# Altium schematic sheet PIXRACER-SERIALS-R12.SchDoc
size A4
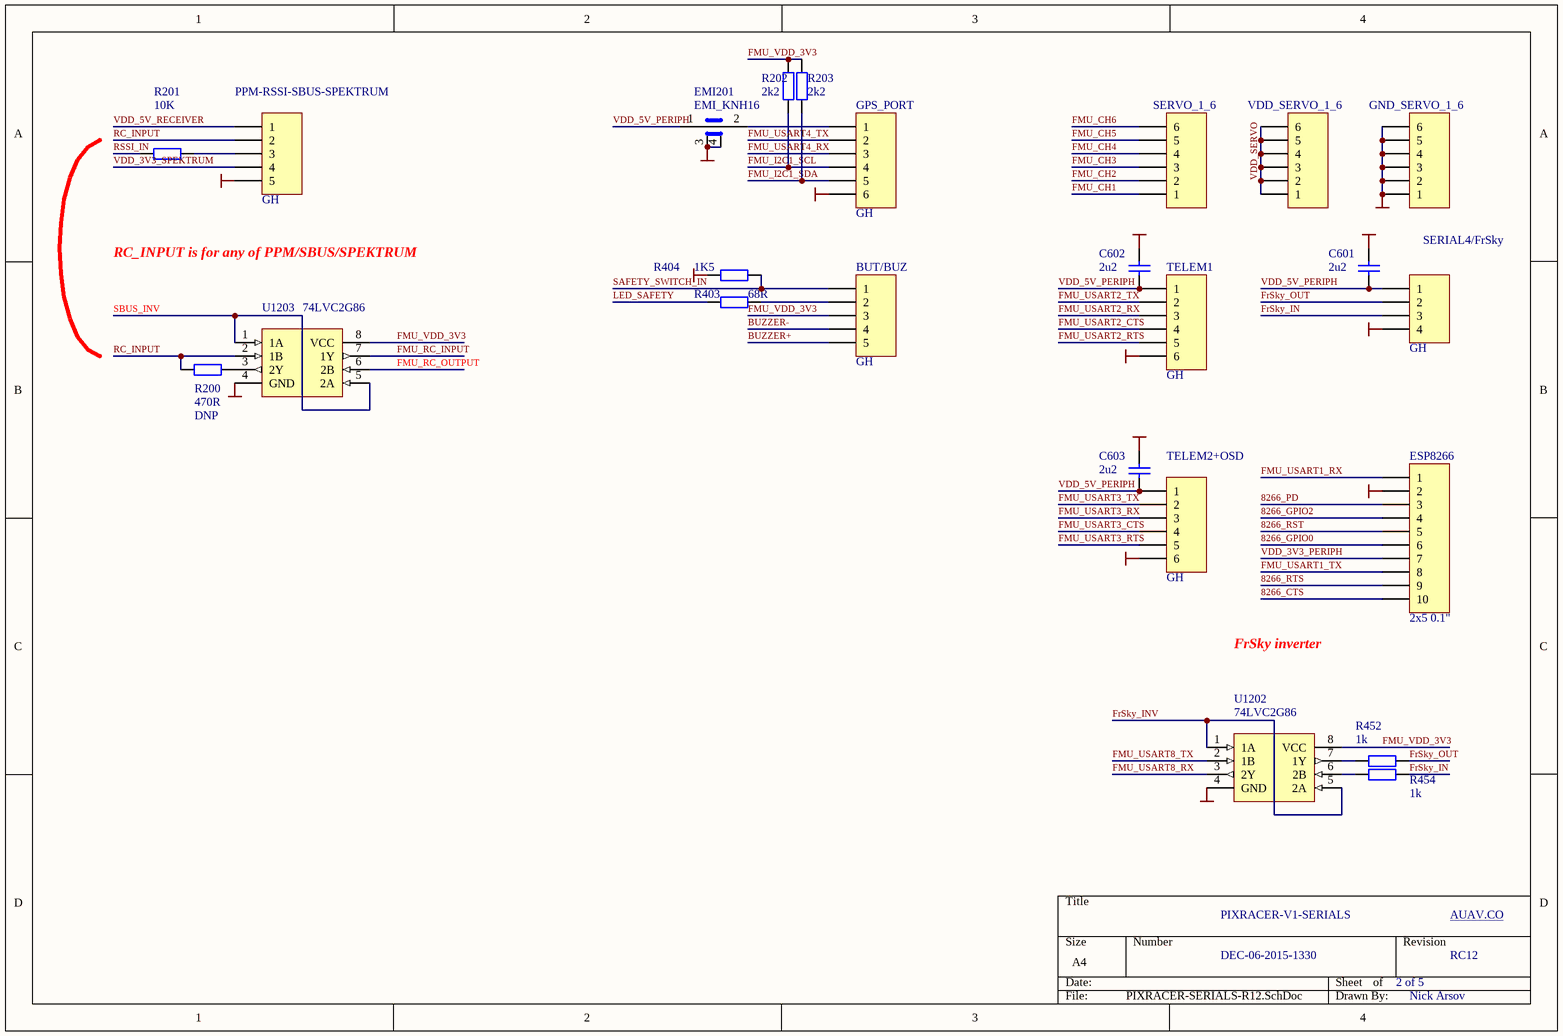
[diagram p0: PIXRACER-SERIALS-R12.SchDoc]

## Parts
BUT/BUZ  GH  [Molex_Clik_1.25_5H]
C601  2u2  [0402A]
C602  2u2  [0402A]
C603  2u2  [0402A]
EMI201  EMI_KNH16  [EMI_KNH16_0603]
ESP8266  2x5 0.1"  [2.54mm_10pin_SMD]
GND_SERVO_1_6  Header 6  [HDR1X6]  (value not drawn)
GPS_PORT  GH  [Molex_Clok_1.25_6H]
PPM-RSSI-SBUS-SPEKTRUM  GH  [Molex_Clik_1.25_5H]
R200  470R  REM: DNP  [0402A]
R201  10K  [0402A]
R202  2k2  [0402A]
R203  2k2  [0402A]
R403  68R  [0402A]
R404  1K5  [0402A]
R452  1k  [0402A]
R454  1k  [0402A]
SERIAL4/FrSky  GH  [Molex_1.25_click_4]
SERVO_1_6  Header 6  [HDR1X6]  (value not drawn)
TELEM1  GH  [Molex_Clok_1.25_6H]
TELEM2+OSD  GH  [Molex_Clok_1.25_6H]
U1202  74LVC2G86  [DCU(SM-8)]
U1203  74LVC2G86  [DCU(SM-8)]
VDD_SERVO_1_6  Header 6  [HDR1X6]  (value not drawn)

## Nets
GND: C601.2 C602.2 C603.2 EMI201.3(G) EMI201.4(G) ESP8266.2 GND_SERVO_1_6.1 GND_SERVO_1_6.2 GND_SERVO_1_6.3 GND_SERVO_1_6.4 GND_SERVO_1_6.5 GND_SERVO_1_6.6 GPS_PORT.6 PPM-RSSI-SBUS-SPEKTRUM.5 R404.2 SERIAL4/FrSky.4 TELEM1.6 TELEM2+OSD.6 U1202.4(GND) U1203.4(GND)
8266_CTS: ESP8266.10
8266_GPIO0: ESP8266.6
8266_GPIO2: ESP8266.4
8266_PD: ESP8266.3
8266_RST: ESP8266.5
8266_RTS: ESP8266.9
BUZZER+: BUT/BUZ.5
BUZZER-: BUT/BUZ.4
FMU_CH1: SERVO_1_6.1
FMU_CH2: SERVO_1_6.2
FMU_CH3: SERVO_1_6.3
FMU_CH4: SERVO_1_6.4
FMU_CH5: SERVO_1_6.5
FMU_CH6: SERVO_1_6.6
FMU_I2C1_SCL: GPS_PORT.4 R202.2
FMU_I2C1_SDA: GPS_PORT.5 R203.2
FMU_RC_INPUT: U1203.7(1Y)
FMU_RC_OUTPUT: U1203.6(2B)
FMU_USART1_RX: ESP8266.1
FMU_USART1_TX: ESP8266.8
FMU_USART2_CTS: TELEM1.4
FMU_USART2_RTS: TELEM1.5
FMU_USART2_RX: TELEM1.3
FMU_USART2_TX: TELEM1.2
FMU_USART3_CTS: TELEM2+OSD.4
FMU_USART3_RTS: TELEM2+OSD.5
FMU_USART3_RX: TELEM2+OSD.3
FMU_USART3_TX: TELEM2+OSD.2
FMU_USART4_RX: GPS_PORT.3
FMU_USART4_TX: GPS_PORT.2
FMU_USART8_RX: U1202.3(2Y)
FMU_USART8_TX: U1202.2(1B)
FMU_VDD_3V3: BUT/BUZ.3 R202.1 R203.1 U1202.8(VCC) U1203.8(VCC)
FrSky_IN: R454.1 SERIAL4/FrSky.3
FrSky_INV: U1202.1(1A) U1202.5(2A)
FrSky_OUT: R452.1 SERIAL4/FrSky.2
LED_SAFETY: R403.2
RC_INPUT: PPM-RSSI-SBUS-SPEKTRUM.2 R200.2 U1203.2(1B)
RSSI_IN: R201.2
SAFETY_SWITCH_IN: BUT/BUZ.1 R404.1
SBUS_INV: U1203.1(1A) U1203.5(2A)
VDD_3V3_PERIPH: ESP8266.7
VDD_3V3_SPEKTRUM: PPM-RSSI-SBUS-SPEKTRUM.4
VDD_5V_PERIPH: C601.1 C602.1 C603.1 EMI201.1(L1) SERIAL4/FrSky.1 TELEM1.1 TELEM2+OSD.1
VDD_5V_RECEIVER: PPM-RSSI-SBUS-SPEKTRUM.1
VDD_SERVO: VDD_SERVO_1_6.1 VDD_SERVO_1_6.2 VDD_SERVO_1_6.3 VDD_SERVO_1_6.4 VDD_SERVO_1_6.5 VDD_SERVO_1_6.6
NetBUT/BUZ_2: BUT/BUZ.2 R403.1
NetEMI201_2: EMI201.2(L2) GPS_PORT.1
NetPPM-RSSI-SBUS-SPEKTRUM_3: PPM-RSSI-SBUS-SPEKTRUM.3 R201.1
NetR200_1: R200.1 U1203.3(2Y)
NetR452_2: R452.2 U1202.7(1Y)
NetR454_2: R454.2 U1202.6(2B)

## Notes on the sheet
- RC_INPUT is for any of PPM/SBUS/SPEKTRUM
- FrSky inverter
- PIXRACER-V1-SERIALS
- AUAV.CO
- DEC-06-2015-1330
- 2 of 5
- RC12
- Nick Arsov

## Library data of the parts
BUT/BUZ PPM-RSSI-SBUS-SPEKTRUM = Header 5: Header, 5-Pin; LatestRevisionDate: 17-Jul-2002; LatestRevisionNote: Re-released for DXP Platform.; Publisher: Altium Limited
C601-C603 = Cap: Capacitor; Value: 100pF; Published: 8-Jun-2000; LatestRevisionDate: 17-Jul-2002; LatestRevisionNote: Re-released for DXP Platform.; PackageReference: RAD-0.3; Publisher: Altium Limited
ESP8266 = Header 10: Header, 10-Pin; LatestRevisionDate: 17-Jul-2002; LatestRevisionNote: Re-released for DXP Platform.; Publisher: Altium Limited
GND_SERVO_1_6 GPS_PORT SERVO_1_6 TELEM1 TELEM2+OSD VDD_SERVO_1_6 = Header 6: Header, 6-Pin; LatestRevisionDate: 17-Jul-2002; LatestRevisionNote: Re-released for DXP Platform.; Publisher: Altium Limited
R200-R203 R403 R404 = Res2: Resistor; Value: 1K; Published: 8-Jun-2000; LatestRevisionDate: 17-Jul-2002; LatestRevisionNote: Re-released for DXP Platform.; PackageReference: AXIAL-0.4; Publisher: Altium Limited
  R202 R203: PackageDescription: Axial Device, Thru-Hole; 2 Leads; 0.4 in Pin Spacing
R452 R454 = Res2: Resistor; Published: 8-Jun-2000; LatestRevisionDate: 17-Jul-2002; LatestRevisionNote: Re-released for DXP Platform.; PackageReference: AXIAL-0.4; Publisher: Altium Limited; PackageDescription: Axial Device, Thru-Hole; 2 Leads; 0.4 in Pin Spacing; Value: 1K
SERIAL4/FrSky = Header 4: Header, 4-Pin; LatestRevisionDate: 17-Jul-2002; LatestRevisionNote: Re-released for DXP Platform.; Publisher: Altium Limited